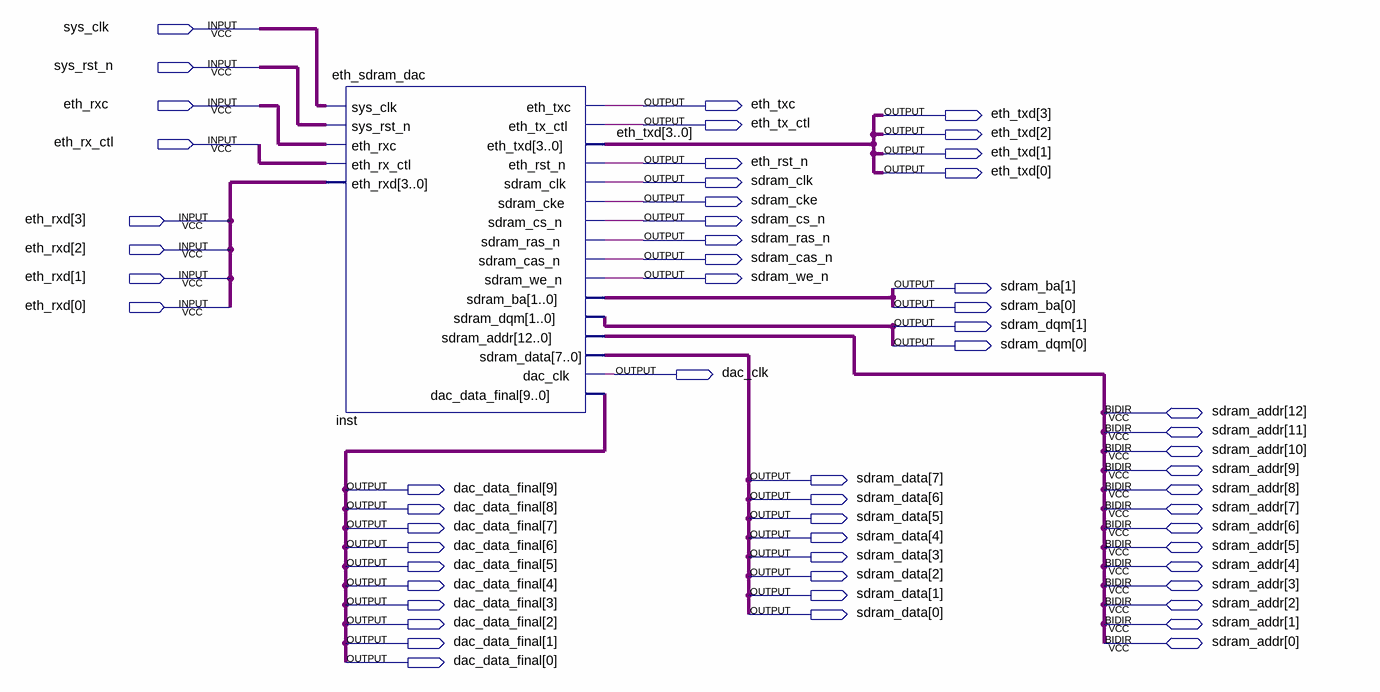
[diagram p0: schematic sheet]
// Quartus schematic bdf_top2.bdf as structural Verilog: 1 symbols, 57 pins
module bdf_top2 (
  input  sys_clk,
  input  sys_rst_n,
  input  eth_rxc,
  input  eth_rx_ctl,
  input  [3:0] eth_rxd,
  inout  [12:0] sdram_addr,
  output eth_txc,
  output [3:0] eth_txd,
  output eth_tx_ctl,
  output eth_rst_n,
  output sdram_clk,
  output sdram_cke,
  output sdram_cs_n,
  output sdram_ras_n,
  output sdram_cas_n,
  output sdram_we_n,
  output [1:0] sdram_ba,
  output [1:0] sdram_dqm,
  output dac_clk,
  output [7:0] sdram_data,
  output [9:0] dac_data_final
);

  wire [3:0] undriven;

  eth_sdram_dac inst (
    .sys_clk(sys_clk), .sys_rst_n(sys_rst_n), .eth_rxc(eth_rxc), .eth_rx_ctl(eth_rx_ctl), .eth_rxd(undriven),
    .eth_txc(eth_txc), .eth_tx_ctl(eth_tx_ctl), .eth_txd(eth_txd), .eth_rst_n(eth_rst_n),
    .sdram_clk(sdram_clk), .sdram_cke(sdram_cke), .sdram_cs_n(sdram_cs_n), .sdram_ras_n(sdram_ras_n),
    .sdram_cas_n(sdram_cas_n), .sdram_we_n(sdram_we_n), .sdram_ba(sdram_ba), .sdram_dqm(sdram_dqm),
    .sdram_addr(sdram_addr), .dac_clk(dac_clk), .dac_data_final(dac_data_final), .sdram_data(sdram_data));
endmodule
